# EAGLE design led_shield (EAGLE 6.4)
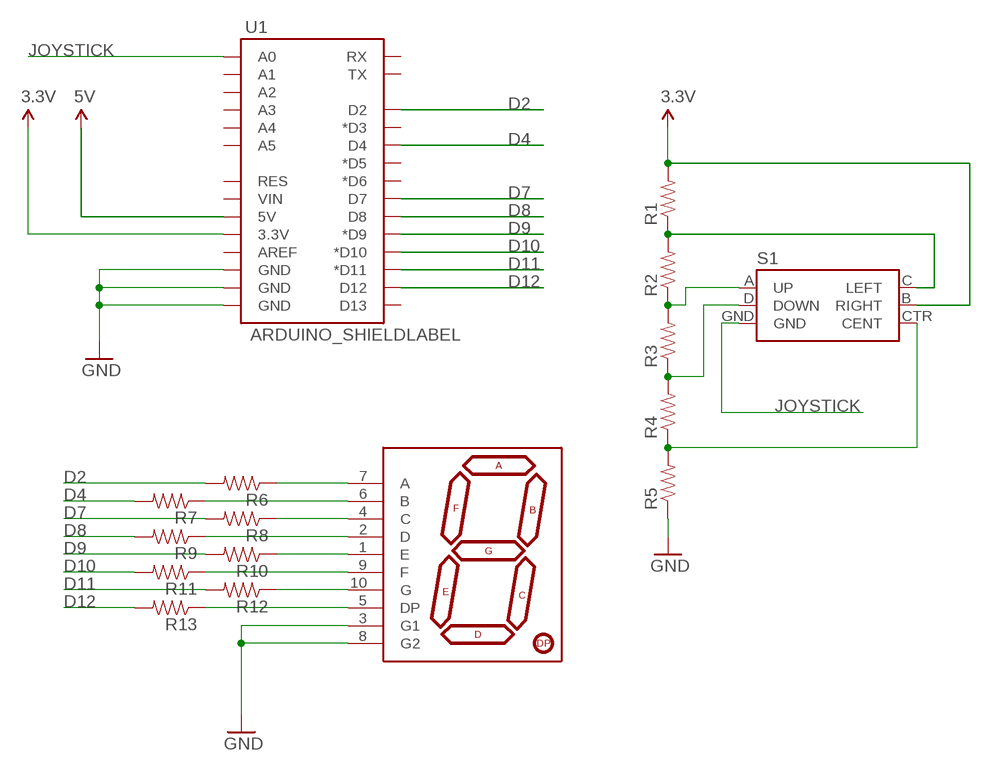
[diagram p0: schematic, sheet 1]

## Parts
R1  RESISTOR0805-RES  [0805]
R2  RESISTOR0805-RES  [0805]
R3  RESISTOR0805-RES  [0805]
R4  RESISTOR0805-RES  [0805]
R5  RESISTOR0805-RES  [0805]
R6  RESISTOR0805-RES  [0805]
R7  RESISTOR0805-RES  [0805]
R8  RESISTOR0805-RES  [0805]
R9  RESISTOR0805-RES  [0805]
R10  RESISTOR0805-RES  [0805]
R11  RESISTOR0805-RES  [0805]
R12  RESISTOR0805-RES  [0805]
R13  RESISTOR0805-RES  [0805]
S1  JOYSTICK_MINI  [JOYSTICK_MINI]
U1  ARDUINO_SHIELDLABEL  [DUEMILANOVE_SHIELD]
U$1  7-SEGMENT-DISPLAY-1"-RED  [7-SEGMENT-1"PTH]

## Nets
3.3V: R1.2 S1.B(RIGHT) U1.3.3V
5V: U1.5V
D2: R6.2 U1.D2
D4: R7.2 U1.D4
D7: R8.2 U1.D7
D8: R9.2 U1.D8
D9: R10.2 U1.D9(*D9)
D10: R11.2 U1.D10(*D10)
D11: R12.2 U1.D11(*D11)
D12: R13.2 U1.D12
GND: R5.1 U1.GND@0(GND) U1.GND@1(GND) U1.GND@2(GND) U$1.3(G1) U$1.8(G2)
JOYSTICK: S1.GND U1.A0
N$1: R1.1 R2.2 S1.C(LEFT)
N$2: R6.1 U$1.7(A)
N$3: R2.1 R3.2 S1.A(UP)
N$4: R3.1 R4.2 S1.D(DOWN)
N$5: R4.1 R5.2 S1.CTR(CENT)
N$6: R7.1 U$1.6(B)
N$7: R8.1 U$1.4(C)
N$8: R9.1 U$1.2(D)
N$9: R10.1 U$1.1(E)
N$10: R11.1 U$1.9(F)
N$11: R12.1 U$1.10(G)
N$12: R13.1 U$1.5(DP)
Unconnected: U1.A1 U1.A2 U1.A3 U1.A4 U1.A5 U1.AREF U1.D3(*D3) U1.D5(*D5) U1.D6(*D6) U1.D13 U1.RES U1.RX U1.TX U1.VIN

## Library data of the parts
R1-R13 = SparkFun-Resistors:RESISTOR: Resistor Basic schematic elements and footprints for 0603, 1206, and PTH resistors.
S1 = SparkFun-Electromechanical:JOYSTICK_MINI: Small 5-way tactile joystick, COM-10063 4UCON SF303GJ26
U1 = SparkFun-Boards:ARDUINO_SHIELD: Arduino shield footprint
U$1 = SparkFun-Displays:7-SEGMENT-DISPLAY-1"-RED: 7-Segment Display 1" Red (COM-08546)

## Board
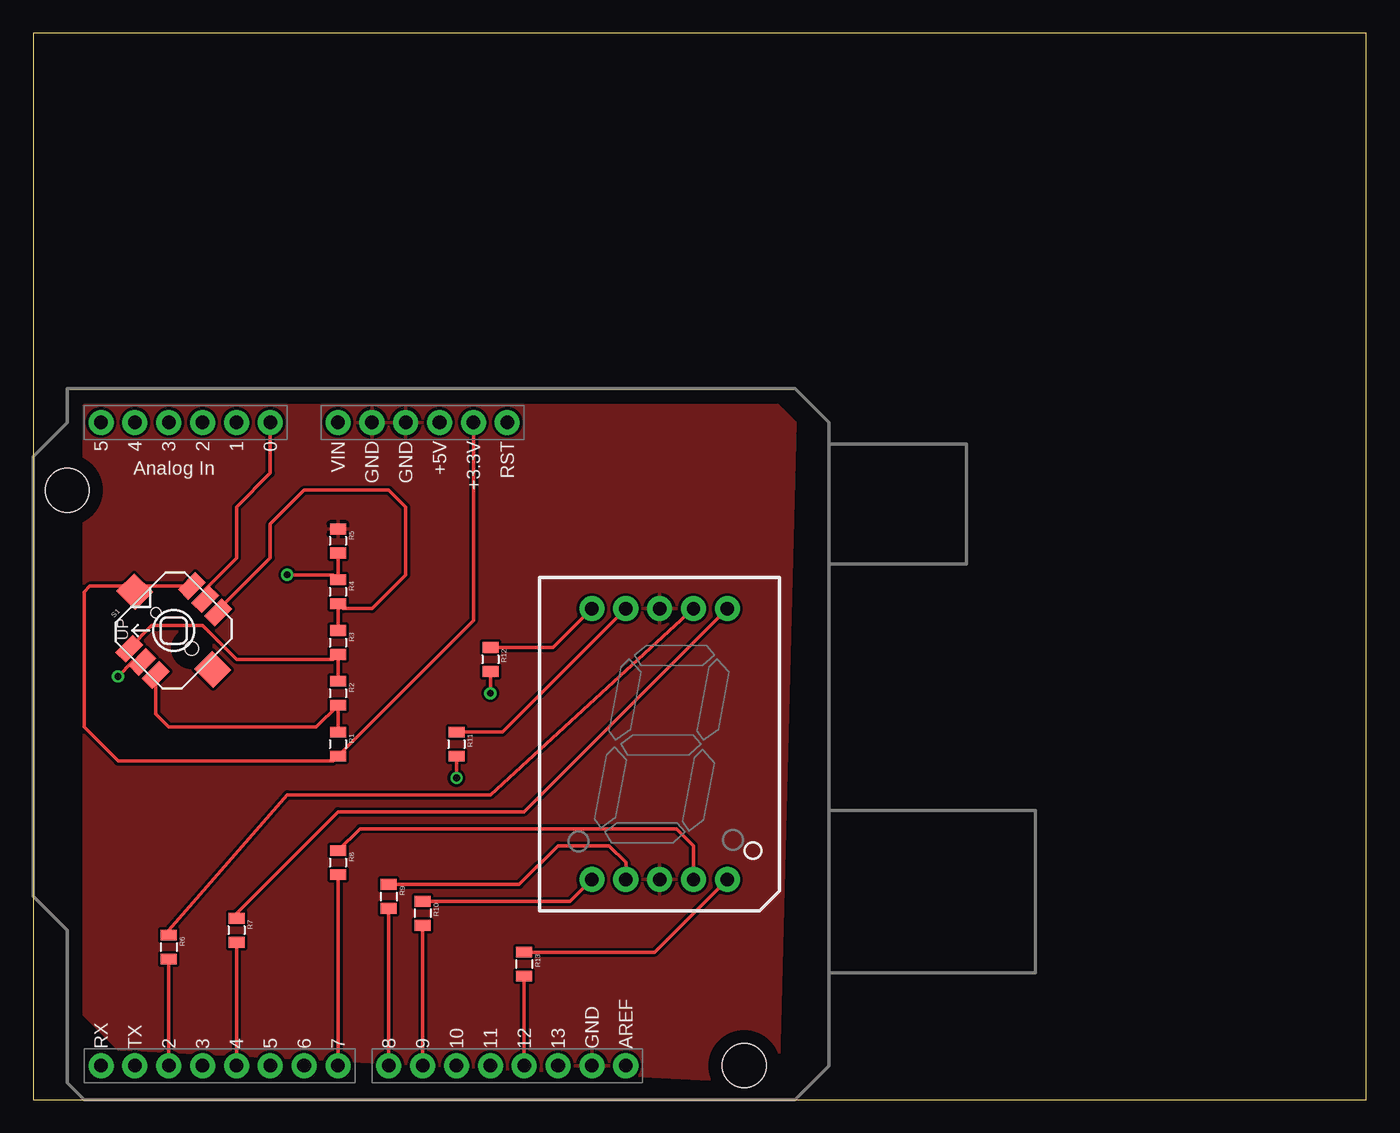
[diagram p1: board, top side]
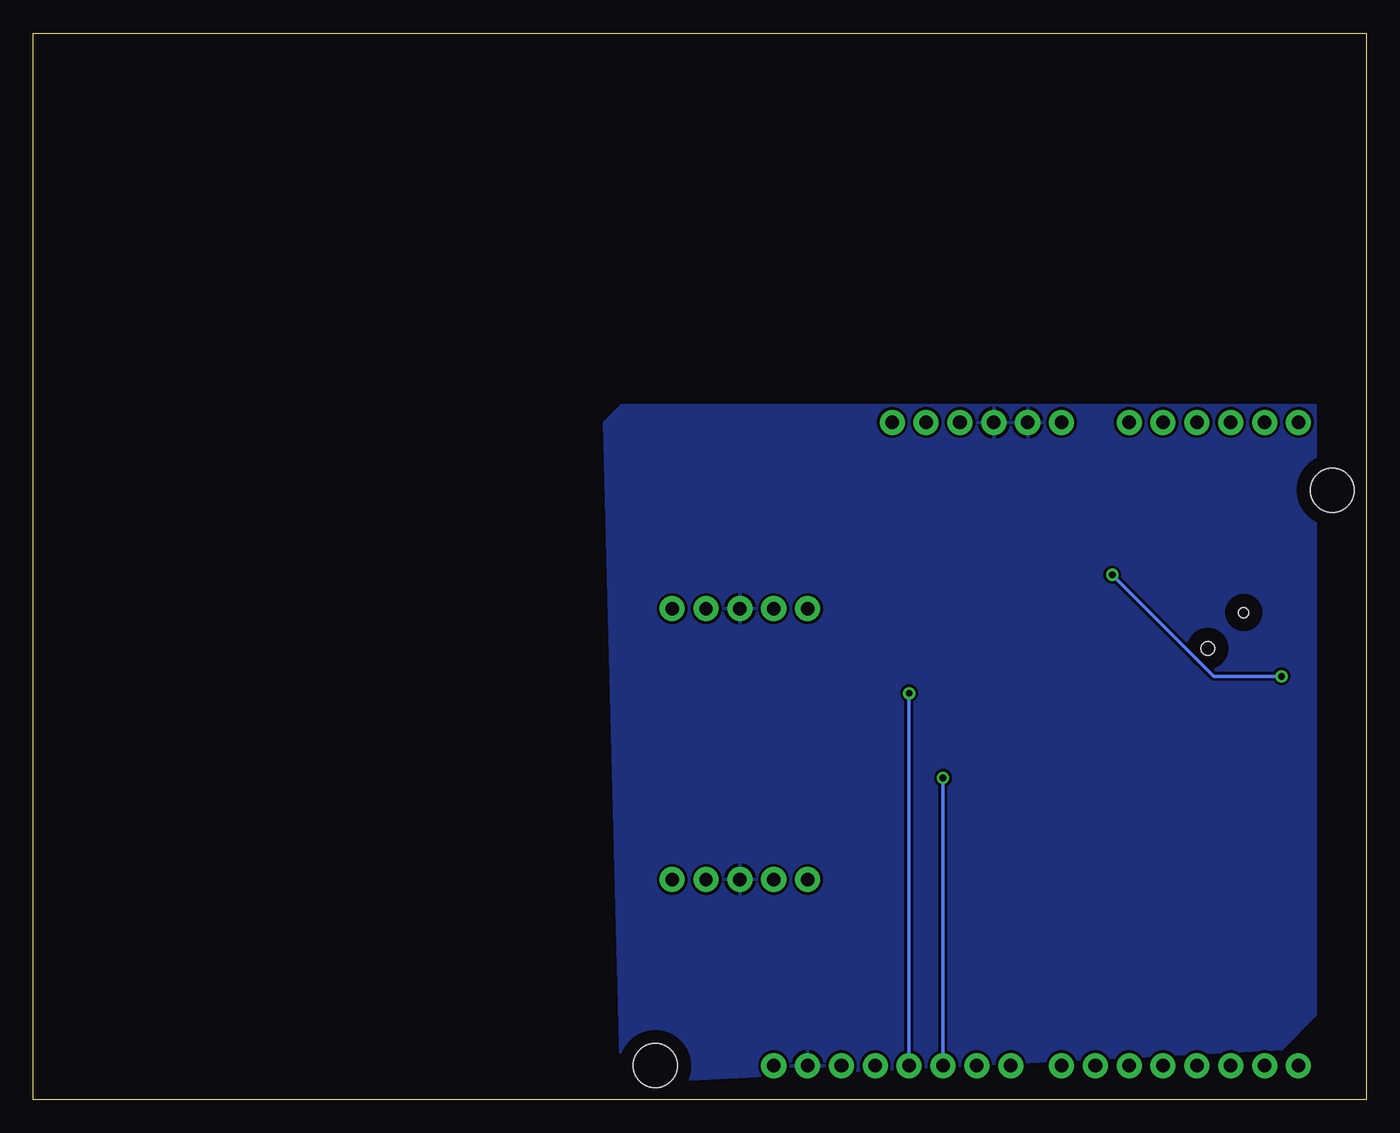
[diagram p2: board, bottom side, seen from below]

Size 100 x 80 mm. Coordinates in mm from the lower left corner, seen from the top.
Outline: 0,0 100,0 100,80 0,80 0,0
Copper layers (1*16): Top 0.035mm / dielectric 1.5mm / Bottom 0.035mm
Design rules "default": minimum track width 10mil, minimum drill 24mil, track to track 8mil, track to pad 8mil, pad to pad 8mil, via to via 8mil, smd to smd 8mil, copper to edge 40mil, drill to drill 8mil, minimum pad ring 10mil, minimum via ring 8mil, stop-mask expansion 4mil, vias tented up to drill 0mil, thermal gap 10mil

### Footprints (pad centres in the part's own frame; a part is rotated, then mirrored left to right if it is on the bottom)
0805 = smd 0.8 x 1.2: 1 -0.9,0; 2 0.9,0
JOYSTICK_MINI = smd 1.85 x 1.1: A -3.325,1.4; B 3.325,1.4; C -3.325,-1.4; CTR -3.325,0; D 3.325,-1.4; GND 3.325,0 | smd 1.9 x 2: NC 0,4.13; NC@0 0,-4.13 | hole 0.75: 0,1.9 | hole 1.05: 0,-1.9
DUEMILANOVE_SHIELD = drill 1.016 pad 1.88: 3.3V 50.8,26.67; 5V 50.8,29.21; A0 50.8,41.91; A1 50.8,44.45; A2 50.8,46.99; A3 50.8,49.53; A4 50.8,52.07; A5 50.8,54.61; AREF 2.54,15.24; D2 2.54,49.53; D3 2.54,46.99; D4 2.54,44.45; D5 2.54,41.91; D6 2.54,39.37; D7 2.54,36.83; D8 2.54,33.02; D9 2.54,30.48; D10 2.54,27.94; D11 2.54,25.4; D12 2.54,22.86; D13 2.54,20.32; GND@0 50.8,31.75; GND@1 50.8,34.29; GND@2 2.54,17.78; RES 50.8,24.13; RX 2.54,54.61; TX 2.54,52.07; VIN 50.8,36.83 | hole 3.302: 45.72,57.15; 2.54,6.35
7-SEGMENT-1"PTH = drill 1 pad 1.88: 1 -5.08,-10.16; 2 -2.54,-10.16; 3 0,-10.16; 4 2.54,-10.16; 5 5.08,-10.16; 6 5.08,10.16; 7 2.54,10.16; 8 0,10.16; 9 -2.54,10.16; 10 -5.08,10.16

### Placement (x,y rotation side)
R1  22.86,26.67 270 top
R2  22.86,30.48 270 top
R3  22.86,34.29 270 top
R4  22.86,38.1 270 top
R5  22.86,41.91 270 top
R6  10.16,11.43 270 top
R7  15.24,12.7 270 top
R8  22.86,17.78 270 top
R9  26.67,15.24 270 top
R10  29.21,13.97 270 top
R11  31.75,26.67 270 top
R12  34.29,33.02 270 top
R13  36.83,10.16 270 top
S1  10.53,35.19 45 top
U1  59.69,0 90 top
U$1  46.99,26.67 0 top

### Tracks (layer width: path | path; a pad name or v marks a point on that pad's centre or on a via)
3.3V
  Top 0.254: U1.3.3V 33.02,35.93 R1.2 22.49,25.4 6.35,25.4 3.81,27.94 3.81,38.1 4.24,38.53 S1.B
D2
  Top 0.254: U1.D2 R6.2
D4
  Top 0.254: U1.D4 R7.2
D7
  Top 0.254: R8.2 U1.D7
D8
  Top 0.254: U1.D8 R9.2
D9
  Top 0.254: R10.2 U1.D9
D10  (via drill 0.51)
  Top 0.254: v31.75,24.13 R11.2
  Bottom 0.254: U1.D10 v31.75,24.13
D11  (via drill 0.51)
  Top 0.254: v34.29,30.48 R12.2
  Bottom 0.254: U1.D11 v34.29,30.48
D12
  Top 0.254: R13.2 U1.D12
GND
  pour Top: 3.81,52.07 55.88,52.07 57.15,50.8 55.88,1.27 6.35,3.81 3.81,6.35
  pour Bottom: 3.81,52.07 55.88,52.07 57.15,50.8 55.88,1.27 6.35,3.81 3.81,6.35
JOYSTICK
  Top 0.254: S1.GND 12.88,38.28 15.24,40.64 15.24,44.45 17.78,46.99 U1.A0
N$1
  Top 0.254: R1.1 R2.2 21.22,27.94 10.16,27.94 9.17,28.93 S1.C
N$2
  Top 0.254: R6.1 10.16,12.7 19.05,22.86 34.29,22.86 U$1.7
N$3
  Top 0.254: R2.1 R3.2 22.49,33.02 15.24,33.02 12.7,35.56 8.89,35.56 7.19,33.86 S1.A
N$4
  Top 0.254: R3.1 R4.2 23.23,36.83 25.4,36.83 27.94,39.37 27.94,44.45 26.67,45.72 20.32,45.72 17.78,43.18 17.78,40.64 13.87,36.73 S1.D
N$5  (via drill 0.51)
  Top 0.254: R5.2 R4.1 22.49,39.37 v19.05,39.37 | S1.CTR 7.44,32.84 v6.35,31.75
  Bottom 0.254: v6.35,31.75 11.43,31.75 v19.05,39.37
N$6
  Top 0.254: R7.1 15.24,13.97 22.86,21.59 36.83,21.59 U$1.6
N$7
  Top 0.254: U$1.4 49.53,19.05 48.26,20.32 24.5,20.32 R8.1
N$8
  Top 0.254: R9.1 36.46,16.14 39.37,19.05 43.18,19.05 44.45,17.78 U$1.2
N$9
  Top 0.254: R10.1 40.27,14.87 U$1.1
N$10
  Top 0.254: R11.1 35.19,27.57 U$1.9
N$11
  Top 0.254: R12.1 39,33.92 U$1.10
N$12
  Top 0.254: R13.1 46.62,11.06 U$1.5